# Altium project SwarmBots.PrjPcb
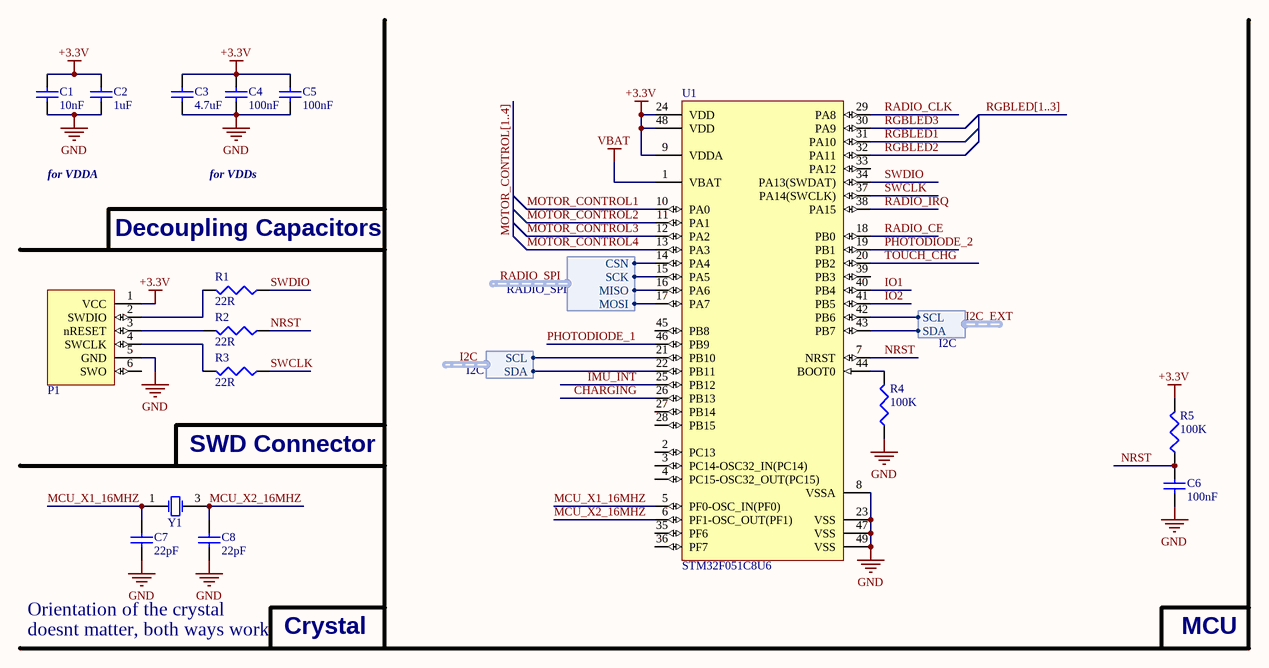
[diagram p0: SBMicrocontroller.SchDoc]
3 sheets, 73 parts. Net scope: global (net labels, ports and power ports of the same name join across sheets).
Board file: SwarmBots.PcbDoc
Sheets:
  SBMicrocontroller.SchDoc
  SBPeripherals.SchDoc
  SBRadio.SchDoc

## Sheet SBMicrocontroller.SchDoc
size A4

### Parts
C1  10nF  [0402]
C2  1uF  [0603]
C3  4.7uF  [0603]
C4  100nF  [0402]
C5  100nF  [0402]
C6  100nF  [0402]
C7  22pF  [0402]
C8  22pF  [0402]
P1  TC2030-IDC-NL  [TC2030-IDC-NL]  (value not drawn)
R1  22R  [0402]
R2  22R  [0402]
R3  22R  [0402]
R4  100K  [0402]
R5  100K  [0402]
U1  STM32F051C8U6  [QFN50P700X700X60_HS-49L]
Y1  7V-16.000MAAE-T  [3.2x2.5 CRYSTAL]  (value not drawn)

### Harnesses
I2C: SDA, SCL
RADIO_SPI: MOSI, MISO, SCK, CSN

### Nets
+3.3V: C1.2 C2.2 C3.2 C4.2 C5.2 P1.1(VCC) R5.2 U1.9(VDDA) U1.24(VDD) U1.48(VDD)
GND: C1.1 C2.1 C3.1 C4.1 C5.1 C6.1 C7.1 C8.1 P1.5(GND) R4.1 U1.8(VSSA) U1.23(VSS) U1.47(VSS) U1.49(VSS) Y1.2(GND) Y1.4(GND)
VBAT: U1.1(VBAT)
CHARGING: U1.26(PB13)
I2C.SCL: U1.21(PB10) ; harness I2C.SCL
I2C.SDA: U1.22(PB11) ; harness I2C.SDA
I2C_EXT.SCL: U1.42(PB6) ; harness I2C.SCL
I2C_EXT.SDA: U1.43(PB7) ; harness I2C.SDA
IMU_INT: U1.25(PB12)
IO1: U1.40(PB4)
IO2: U1.41(PB5)
MCU_X1_16MHZ: C7.2 U1.5(PF0-OSC_IN(PF0)) Y1.1(X1)
MCU_X2_16MHZ: C8.2 U1.6(PF1-OSC_OUT(PF1)) Y1.3(X2)
MOTOR_CONTROL1: U1.10(PA0)
MOTOR_CONTROL2: U1.11(PA1)
MOTOR_CONTROL3: U1.12(PA2)
MOTOR_CONTROL4: U1.13(PA3)
NRST: C6.2 R2.1 R5.1 U1.7(NRST)
PHOTODIODE_1: U1.46(PB9)
PHOTODIODE_2: U1.19(PB1)
RADIO_CE: U1.18(PB0)
RADIO_CLK: U1.29(PA8)
RADIO_IRQ: U1.38(PA15)
RADIO_SPI.CSN: U1.14(PA4) ; harness RADIO_SPI.CSN
RADIO_SPI.MISO: U1.16(PA6) ; harness RADIO_SPI.MISO
RADIO_SPI.MOSI: U1.17(PA7) ; harness RADIO_SPI.MOSI
RADIO_SPI.SCK: U1.15(PA5) ; harness RADIO_SPI.SCK
RGBLED1: U1.31(PA10)
RGBLED2: U1.32(PA11)
RGBLED3: U1.30(PA9)
SWCLK: R3.1 U1.37(PA14(SWCLK))
SWDIO: R1.1 U1.34(PA13(SWDAT))
~{TOUCH_CHG}: U1.20(PB2)
NetP1_2: P1.2(SWDIO) R1.2
NetP1_3: P1.3(nRESET) R2.2
NetP1_4: P1.4(SWCLK) R3.2
NetR4_2: R4.2 U1.44(BOOT0)

Not connected (* = marked no-connect by the designer): P1 6(SWO); U1 2(PC13) 3(PC14-OSC32_IN(PC14)) 4(PC15-OSC32_OUT(PC15)) 27(PB14) 28(PB15) 33(PA12) 35(PF6) 36(PF7) 39(PB3) 45(PB8)

### Buses and harness runs
bus MOTOR_CONTROL[1..4]
bus RGBLED[1..3]

### Notes on the sheet
- for VDDA
- Decoupling Capacitors
- for VDDs
- SWD Connector
- Orientation of the crystal
- doesnt matter, both ways work
- Crystal
- MCU

### Library data of the parts
C1 = 10nF: 10nF 0402 X7R 25V ±5%; Supplier 1: Farnell; Supplier Part Number 1: 1692285; Supplier 2: Digi-Key; Supplier Part Number 2: 399-1279-1-ND; Value: 10nF
C2 = 1uF: 1uF 0603 X5R 10V ±10%; Supplier 1: Farnell; Supplier Part Number 1: 1759399; Supplier 2: Digi-Key; Supplier Part Number 2: 478-1251-1-ND; Value: 1uF
C3 = 4.7uF: 4.7uF 0603 X5R 10V ±10%; Supplier 1: Farnell; Supplier Part Number 1: 2362098; Supplier 2: Digi-Key; Supplier Part Number 2: 445-5170-1-ND; Value: 4.7uF
C4-C6 = 100nF: 100nF 0402 X7R 16V ±10%; Supplier 1: Farnell; Supplier Part Number 1: 1288252; Supplier 2: Digi-Key; Supplier Part Number 2: 399-3521-1-ND; Value: 100nF
C7 C8 = 22pF: 22pF 0402 NP0/CG0 50V ±5%; Supplier 1: Farnell; Supplier 2: Digi-Key; Supplier Part Number 1: 1414580; Supplier Part Number 2: 490-5868-1-ND; Value: 22pF
P1 = TC2030-IDC-NL: TagConnect TC2030-IDC-NL SWD Programming Connector
R1-R3 = 22R: 22R 0402 1/16W ±1%; Supplier 1: Farnell; Supplier 2: Digi-Key; Supplier Part Number 1: 2072797; Supplier Part Number 2: 541-22.0LCT-ND; Value: 22R
R4 R5 = 100K: 100K 0402 1/16W ±1%; Supplier 1: Farnell; Supplier Part Number 1: 2072519; Supplier 2: Digi-Key; Supplier Part Number 2: 541-100KLCT-ND; Value: 100K
U1 = STM32F051C8U6: STMICROELECTRONICS  STM32F051C8U6  MCU 32BIT CORTEX-M0 48MHZ UFQFPN-48; Supplier 1: Farnell; Supplier 2: Digi-Key; Supplier Part Number 1: 2393638; Supplier Part Number 2: STM32F051C8U6-ND
Y1 = 7V-16.000MAAE-T: TXC - 7V-16.000MAAE-T, 16MHZ, 30PPM, 12PF - CRYSTAL; Supplier 1: Digi-Key; Supplier 2: Farnell; Supplier Part Number 1: 887-1462-1-ND; Supplier Part Number 2: 1892172

## Sheet SBPeripherals.SchDoc
size A4
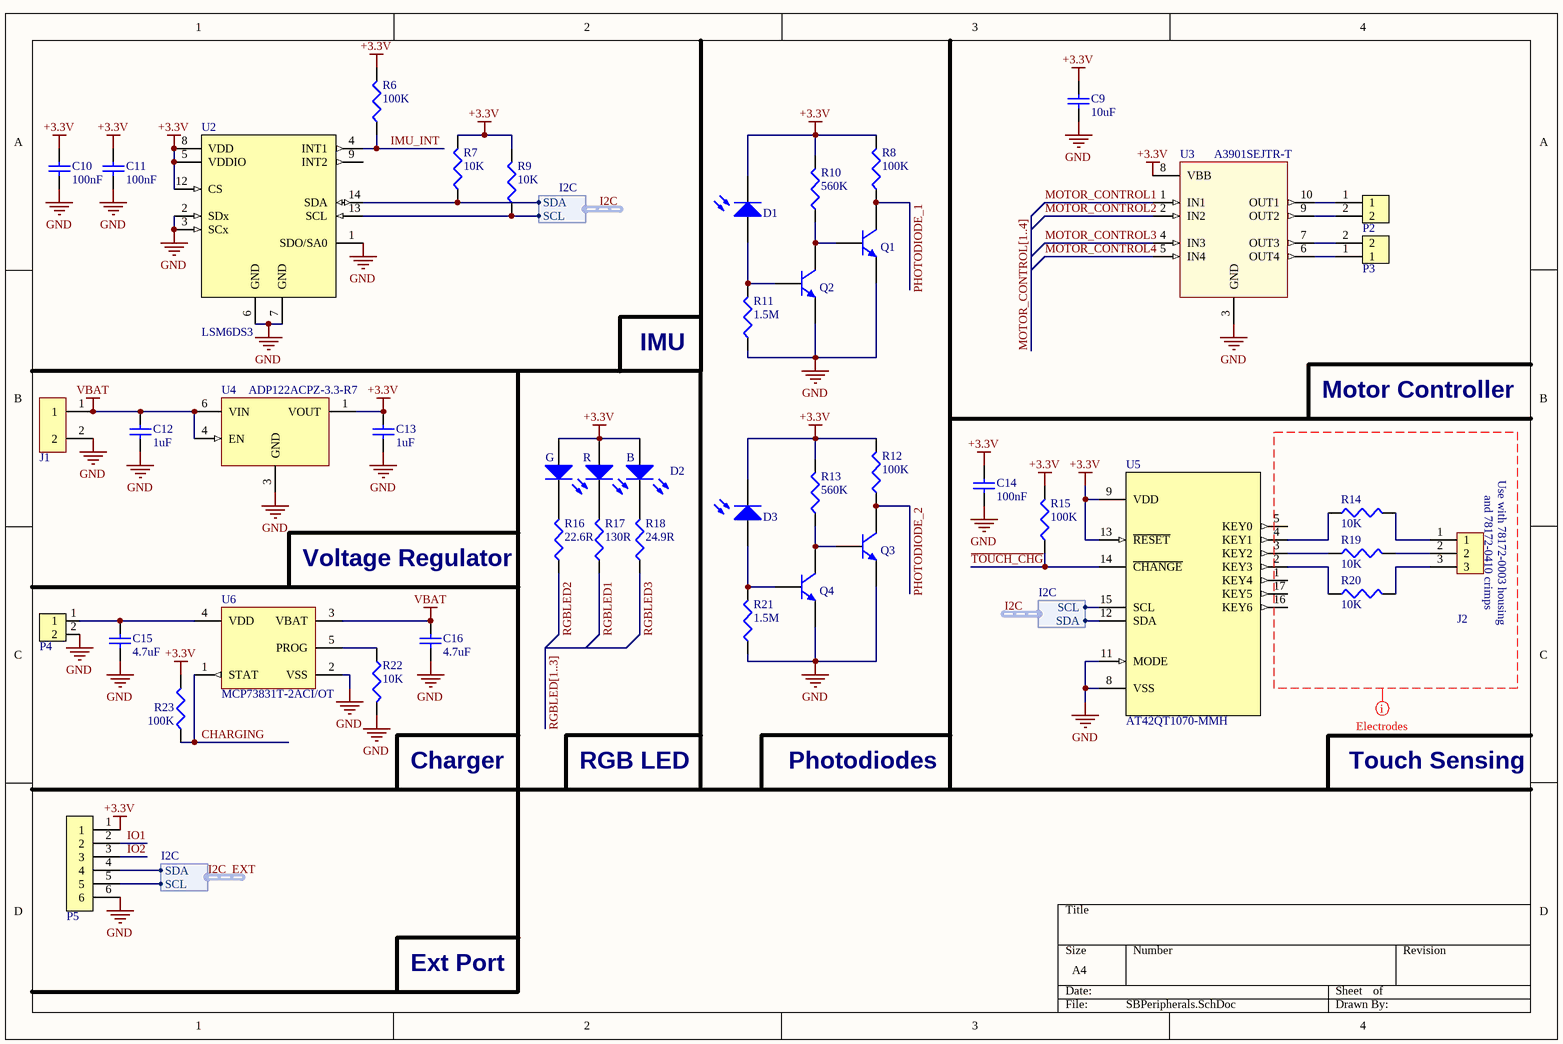
[diagram p1: SBPeripherals.SchDoc]

### Parts
C9  10uF  [0603]
C10  100nF  [0402]
C11  100nF  [0402]
C12  1uF  [0603]
C13  1uF  [0603]
C14  100nF  [0402]
C15  4.7uF  [0603]
C16  4.7uF  [0603]
D1  PD15-22C/TR8  [PD15-22C/TR8]  (value not drawn)
D2  SMLVN6RGB1W1  [3.5x2.8 mm 6-SMD]  (value not drawn)
D3  PD15-22C/TR8  [PD15-22C/TR8]  (value not drawn)
J1  78171-0002  [78171-0002]  (value not drawn)
J2  78171-0003  [78171-0003]  (value not drawn)
P2  HEADER 2X1 0.05" UNPOLARIZED  [HEADER 2X1 0.05" - UNPOLARIZED]  (value not drawn)
P3  HEADER 2X1 0.05" UNPOLARIZED  [HEADER 2X1 0.05" - UNPOLARIZED]  (value not drawn)
P4  CHARGING PAD  [Charging Pad]  (value not drawn)
P5  EXTENSION_PORT  [EXTENSION_PORT]  (value not drawn)
Q1  MMBT3904L  [SOT23_L]  (value not drawn)
Q2  MMBT3904L  [SOT23_L]  (value not drawn)
Q3  MMBT3904L  [SOT23_L]  (value not drawn)
Q4  MMBT3904L  [SOT23_L]  (value not drawn)
R6  100K  [0402]
R7  10K  [0402]
R8  100K  [0402]
R9  10K  [0402]
R10  560K  [0402]
R11  1.5M  [0402]
R12  100K  [0402]
R13  560K  [0402]
R14  10K  [0402]
R15  100K  [0402]
R16  22.6R  [0402]
R17  130R  [0402]
R18  24.9R  [0402]
R19  10K  [0402]
R20  10K  [0402]
R21  1.5M  [0402]
R22  10K  [0402]
R23  100K  [0402]
U2  LSM6DS3  [LGA-14 2.5x3x0.86 mm 14L]
U3  A3901SEJTR-T  [DFN50P300X300X75_HS-11N]
U4  ADP122ACPZ-3.3-R7  [LFCSP-6 2.0X2.0X0.55]
U5  AT42QT1070-MMH  [QFN45P300X300X85_HS-21L]
U6  MCP73831T-2ACI/OT  [SOT-23-OT5_L]

### Harnesses
I2C: SDA, SCL

### Nets
+3.3V: C9.2 C10.2 C11.2 C13.2 C14.2 D1.2(K) D2.1(AB) D2.2(AR) D2.3(AG) D3.2(K) P5.1 R6.2 R7.2 R8.2 R9.2 R10.2 R12.2 R13.2 R15.2 R23.2 U2.5(VDDIO) U2.8(VDD) U2.12(CS) U3.8(VBB) U4.1(VOUT) U5.9(VDD) U5.13(~{RESET})
GND: C9.1 C10.1 C11.1 C12.1 C13.1 C14.1 C15.1 C16.1 J1.2 P4.2 P5.6 Q1.2(E) Q2.2(E) Q3.2(E) Q4.2(E) R11.1 R21.1 R22.2 U2.1(SDO/SA0) U2.2(SDx) U2.3(SCx) U2.6(GND) U2.7(GND) U3.3(GND) U3.11(PAD) U4.2(NC) U4.3(GND) U4.5(NC) U4.7(THPAD) U5.8(VSS) U5.11(MODE) U5.21(PAD) U6.2(VSS)
VBAT: C12.2 C16.2 J1.1 U4.4(EN) U4.6(VIN) U6.3(VBAT)
CHARGING: R23.1 U6.1(STAT)
I2C.SCL: R9.1 U2.13(SCL) U5.15(SCL) ; harness I2C.SCL
I2C.SDA: R7.1 U2.14(SDA) U5.12(SDA) ; harness I2C.SDA
I2C_EXT.SCL: P5.5 ; harness I2C.SCL
I2C_EXT.SDA: P5.4 ; harness I2C.SDA
IMU_INT: R6.1 U2.4(INT1)
IO1: P5.2
IO2: P5.3
MOTOR_CONTROL1: U3.1(IN1)
MOTOR_CONTROL2: U3.2(IN2)
MOTOR_CONTROL3: U3.4(IN3)
MOTOR_CONTROL4: U3.5(IN4)
PHOTODIODE_1: Q1.3(C) R8.1
PHOTODIODE_2: Q3.3(C) R12.1
RGBLED1: R17.1
RGBLED2: R16.1
RGBLED3: R18.1
~{TOUCH_CHG}: R15.1 U5.14(~{CHANGE})
NetC15_2: C15.2 P4.1 U6.4(VDD)
NetD1_1: D1.1(A) Q2.1(B) R11.2
NetD2_4: D2.4(KG) R16.2
NetD2_5: D2.5(KR) R17.2
NetD2_6: D2.6(KB) R18.2
NetD3_1: D3.1(A) Q4.1(B) R21.2
NetJ2_1: J2.1 R14.2
NetJ2_2: J2.2 R19.2
NetJ2_3: J2.3 R20.2
NetP2_1: P2.1 U3.10(OUT1)
NetP2_2: P2.2 U3.9(OUT2)
NetP3_1: P3.1 U3.6(OUT4)
NetP3_2: P3.2 U3.7(OUT3)
NetQ1_1: Q1.1(B) Q2.3(C) R10.1
NetQ3_1: Q3.1(B) Q4.3(C) R13.1
NetR14_1: R14.1 U5.4(KEY1)
NetR19_1: R19.1 U5.3(KEY2)
NetR20_1: R20.1 U5.2(KEY3)
NetR22_1: R22.1 U6.5(PROG)

Not connected (* = marked no-connect by the designer): U2 9(INT2) 10(OCS) 11(NC); U5 1(KEY4) 5(KEY0) 6(NC) 7(NC) 10(NC) 16(KEY6) 17(KEY5) 18(NC) 19(NC) 20(NC)

### Buses and harness runs
bus MOTOR_CONTROL[1..4]
bus RGBLED[1..3]

### Layout directives
net class Electrodes: (no net found under the mark)

### Notes on the sheet
- IMU
- Motor Controller
- Voltage Regulator
- Charger
- RGB LED
- Photodiodes
- Touch Sensing
- Ext Port
- (in symbol 78171-0003) and 78172-0410 crimps; Use with 78172-0003 housing
- (in symbol SMLVN6RGB1W1) G; R; B

### Library data of the parts
C9 = 10uF: 10uF 0603 X5R 6.3V ±20%; Supplier 1: Farnell; Supplier Part Number 1: 2456110; Supplier 2: Digi-Key; Supplier Part Number 2: 490-10475-1-ND; Value: 10uF
C10 C11 C14 = 100nF: 100nF 0402 X7R 16V ±10%; Supplier 1: Farnell; Supplier Part Number 1: 1288252; Supplier 2: Digi-Key; Supplier Part Number 2: 399-3521-1-ND; Value: 100nF
C12 C13 = 1uF: 1uF 0603 X5R 10V ±10%; Supplier 1: Farnell; Supplier Part Number 1: 1759399; Supplier 2: Digi-Key; Supplier Part Number 2: 478-1251-1-ND; Value: 1uF
C15 C16 = 4.7uF: 4.7uF 0603 X5R 10V ±10%; Supplier 1: Farnell; Supplier Part Number 1: 2362098; Supplier 2: Digi-Key; Supplier Part Number 2: 445-5170-1-ND; Value: 4.7uF
D1 D3 = PD15-22C/TR8: Everlight PD15-22C/TR8 Silicon PIN Photodiode; Supplier 1: Digi-Key; Supplier Part Number 1: 1080-1367-1-ND
D2 = SMLVN6RGB1W1: ROHM SMLVN6RGB1W1 LED Tri-Color Blue/Green/Red Chip LED 6-Pin 1411 T/RLED Tri-Color Blue/Green/Red Chip LED 6-Pin 1411; Supplier 1: Mouser; Supplier 2: Digi-Key; Supplier Part Number 1: 755-SMLVN6RGB1W1; Supplier Part Number 2: 846-1187-1-ND
J1 = 78171-0002: Molex Pico-EZmate™ Wire-to-Board Header, 2 contacts; Supplier 1: Farnell; Supplier 2: Digi-Key; Supplier Part Number 1: 2313710; Supplier Part Number 2: WM4459CT-ND
J2 = 78171-0003: Molex Pico-EZmate™ Wire-to-Board Header, 3 contacts; Supplier 1: Farnell; Supplier 2: Digi-Key; Supplier Part Number 1: 2313562; Supplier Part Number 2: WM5409CT-ND
Q1-Q4 = MMBT3904L: On Semiconductor MMBT3904L General Purpose Transistor  NPN Silicon; Supplier 1: Farnell; Supplier 2: Digi-Key; Supplier Part Number 1: 1459100; Supplier Part Number 2: MMBT3904LT1GOSCT-ND
R6 R8 R12 R15 R23 = 100K: 100K 0402 1/16W ±1%; Supplier 1: Farnell; Supplier Part Number 1: 2072519; Supplier 2: Digi-Key; Supplier Part Number 2: 541-100KLCT-ND; Value: 100K
R7 R9 R14 R19 R20 R22 = 10K: 10K 0402 1/16W ±1%; Supplier 1: Farnell; Supplier Part Number 1: 2072517; Supplier 2: Digi-Key; Supplier Part Number 2: 541-10.0KLCT-ND; Value: 10K
R10 R13 = 560K: 560K 0402 1/16W ±1%; Supplier 1: Farnell; Supplier Part Number 1: 2074116; Supplier 2: Digi-Key; Supplier Part Number 2: 311-560KLRCT-ND; Value: 560K
R11 R21 = 1.5M: 1.5M 0402 1/16W ±1%; Supplier 1: Farnell; Supplier Part Number 1: 2141473; Supplier 2: Digi-Key; Supplier Part Number 2: 541-1.50MLCT-ND; Value: 1.5M
R16 = 22.6R: 22.6R 0402 1/16W ±0.05R; Supplier 1: Farnell; Supplier 2: Digi-Key; Supplier Part Number 1: 2302454; Supplier Part Number 2: P22.6LCT-ND; Value: 22.6R
R17 = 130R: 130R 0402 1/16W ±0.05R; Supplier 1: Farnell; Supplier 2: Digi-Key; Supplier Part Number 1: 2059115; Supplier Part Number 2: P130LCT-ND; Value: 130R
R18 = 24.9R: 24.9R 0402 1/16W ±0.05R; Supplier 1: Farnell; Supplier 2: Digi-Key; Supplier Part Number 1: 2059102; Supplier Part Number 2: P24.9LCT-ND; Value: 24.9R
U2 = LSM6DS3: STMicroelectronics iNEMO inertial module:   3D accelerometer and 3D gyroscope; Supplier 1: Farnell; Supplier Part Number 1: 2474253; Supplier 2: Digi-Key; Supplier Part Number 2: 497-15383-1-ND
U3 = A3901SEJTR-T: ALLEGRO MICROSYSTEMS - A3901SEJTR-T - IC, MOTOR DRIVER; Supplier 1: Farnell; Supplier 2: Digi-Key; Supplier Part Number 1: 1651947; Supplier Part Number 2: 620-1159-1-ND
U4 = ADP122ACPZ-3.3-R7: Analog Devices ADP122ACPZ-3.3-R7 - 5.5 V Input, 300 mA, Low Quiescent  Current, CMOS Linear Regulator; Supplier 1: Farnell; Supplier 2: Digi-Key; Supplier Part Number 1: 2457164; Supplier Part Number 2: ADP122ACPZ-3.3-R7CT-ND
U5 = AT42QT1070-MMH: Atmel Seven-channel QTouch® Touch Sensor IC; Supplier 1: Digi-Key; Supplier Part Number 1: AT42QT1070-MMHCT-ND
U6 = MCP73831T-2ACI/OT: Miniature Single-Cell, Fully Integrated Li-Ion, Li-Polymer Charge Management Controller, 4.2V, 5-Pin SOT-23, Industrial Temperature, Tape and Reel; Published: 29-Jan-2009; LatestRevisionDate: 27-Nov-2009; LatestRevisionNote: Updated to datasheet revision E, Sep-2008; DatasheetVersion: revE, Sep-2008; PackageVersion: revBB, Aug-2009; PackageReference: SOT-23-OT5; Publisher: Altium Limited; PackageDescription: 5-Lead Plastic Small Outline Transistor (OT) [SOT-23]; Supplier 1: Farnell; Supplier Part Number 1: 1332158; Code_IPC: SOT23-5; ComponentLink1Description: Datasheet; ComponentLink1URL: http://ww1.microchip.com/downloads/en/DeviceDoc/21984e.pdf; ComponentLink2Description: Packaging Specification; ComponentLink2URL: http://www.microchip.com/stellent/groups/techpub_sg/documents/packagingspec/en012702.pdf; ComponentLink3Description: Microchip.com Home; ComponentLink3URL: http://www.microchip.com/

## Sheet SBRadio.SchDoc
size A4
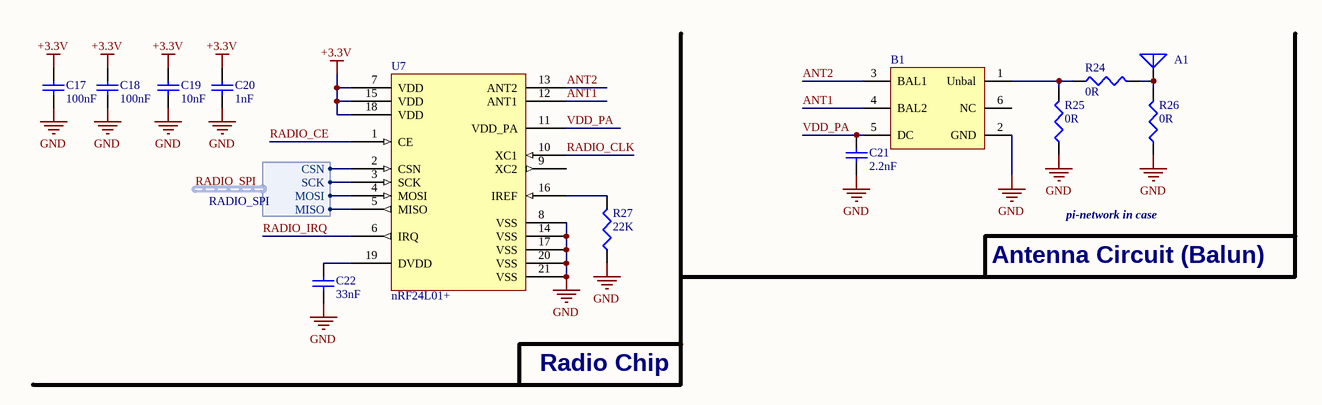
[diagram p2: SBRadio.SchDoc]

### Parts
A1  2450AT18D0100  [2450AT18D0100]  (value not drawn)
B1  2450BM14A0002T  [2450BM14A0002]  (value not drawn)
C17  100nF  [0402]
C18  100nF  [0402]
C19  10nF  [0402]
C20  1nF  [0402]
C21  2.2nF  [0402]
C22  33nF  [0402]
R24  0R  [0402]
R25  0R  [0402]
R26  0R  [0402]
R27  value 22K  [0402]  (hidden comment: 22K 0402 1/16W ±1%)
U7  nRF24L01+  [QFN50P400X400X95_HS-21L]

### Harnesses
RADIO_SPI: MOSI, MISO, SCK, CSN

### Nets
+3.3V: C17.2 C18.2 C19.2 C20.2 U7.7(VDD) U7.15(VDD) U7.18(VDD)
GND: A1.2(GND) B1.2(GND) C17.1 C18.1 C19.1 C20.1 C21.1 C22.1 R25.1 R26.1 R27.1 U7.8(VSS) U7.14(VSS) U7.17(VSS) U7.20(VSS) U7.21(VSS)
ANT1: B1.4(BAL2) U7.12(ANT1)
ANT2: B1.3(BAL1) U7.13(ANT2)
RADIO_CE: U7.1(CE)
RADIO_CLK: U7.10(XC1)
RADIO_IRQ: U7.6(IRQ)
RADIO_SPI.CSN: U7.2(CSN) ; harness RADIO_SPI.CSN
RADIO_SPI.MISO: U7.5(MISO) ; harness RADIO_SPI.MISO
RADIO_SPI.MOSI: U7.4(MOSI) ; harness RADIO_SPI.MOSI
RADIO_SPI.SCK: U7.3(SCK) ; harness RADIO_SPI.SCK
VDD_PA: B1.5(DC) C21.2 U7.11(VDD_PA)
NetA1_1: A1.1(A) R24.2 R26.2
NetB1_1: B1.1(Unbal) R24.1 R25.2
NetC22_2: C22.2 U7.19(DVDD)
NetR27_2: R27.2 U7.16(IREF)

Not connected (* = marked no-connect by the designer): B1 6(NC); U7 9(XC2)

### Notes on the sheet
- pi-network in case
- Antenna Circuit (Balun)
- Radio Chip

### Library data of the parts
A1 = 2450AT18D0100: JOHANSON TECHNOLOGY 2450AT18D0100  ANTENNA, CERAMIC, 2.45GHZ; Supplier 1: Mouser; Supplier 2: Digi-Key; Supplier Part Number 1: 609-2450AT18D0100E; Supplier Part Number 2: 712-1573-1-ND
B1 = 2450BM14A0002T: Johanson Technology Impedance Matched Balun Filter Integrated Passive for nRF24L01; Supplier 1: Farnell; Supplier 2: Digi-Key; Supplier Part Number 1: 2148533; Supplier Part Number 2: 712-1574-1-ND
C17 C18 = 100nF: 100nF 0402 X7R 16V ±10%; Supplier 1: Farnell; Supplier Part Number 1: 1288252; Supplier 2: Digi-Key; Supplier Part Number 2: 399-3521-1-ND; Value: 100nF
C19 = 10nF: 10nF 0402 X7R 25V ±5%; Supplier 1: Farnell; Supplier Part Number 1: 1692285; Supplier 2: Digi-Key; Supplier Part Number 2: 399-1279-1-ND; Value: 10nF
C20 = 1nF: 1nF 0402 X7R 50V ±10%; Supplier 1: Farnell; Supplier 2: Digi-Key; Supplier Part Number 1: 1414573; Supplier Part Number 2: 399-1032-1-ND; Value: 1nF
C21 = 2.2nF: 2.2nF 0402 X7R 50V ±10%; Supplier 1: Farnell; Supplier 2: Digi-Key; Supplier Part Number 1: 1414582; Supplier Part Number 2: 399-3068-1-ND; Value: 2.2nF
C22 = 33nF: 33nF 0402 X7R 50V ±10%; Supplier 1: Farnell; Supplier 2: Digi-Key; Supplier Part Number 1: 2210826; Supplier Part Number 2: 445-7334-1-ND; Value: 33nF
R24-R26 = 0R: 0R 0402 1/16W ±0.05R; Supplier 1: Farnell; Supplier 2: Digi-Key; Supplier Part Number 1: 2072513; Supplier Part Number 2: P0.0JCT-ND; Value: 0R
R27 = 22K: Supplier 1: Farnell; Supplier 2: Digi-Key; Supplier Part Number 1: 2072781; Supplier Part Number 2: 541-22.0KLCT-ND
U7 = nRF24L01+: Nordic Semi Ultra low power 2.4GHz RF Transceiver IC; Supplier 1: Digi-Key; Supplier Part Number 1: 1490-1033-1-ND

## Nets that join several sheets
+3.3V: SBMicrocontroller (10 pins), SBPeripherals (27 pins), SBRadio (7 pins)
GND: SBMicrocontroller (16 pins), SBPeripherals (33 pins), SBRadio (16 pins)
VBAT: SBMicrocontroller (U1.1), SBPeripherals (6 pins)
CHARGING: SBMicrocontroller (U1.26), SBPeripherals (R23.1 U6.1)
I2C.SCL: SBMicrocontroller (U1.21), SBPeripherals (R9.1 U2.13 U5.15)
I2C.SDA: SBMicrocontroller (U1.22), SBPeripherals (R7.1 U2.14 U5.12)
I2C_EXT.SCL: SBMicrocontroller (U1.42), SBPeripherals (P5.5)
I2C_EXT.SDA: SBMicrocontroller (U1.43), SBPeripherals (P5.4)
IMU_INT: SBMicrocontroller (U1.25), SBPeripherals (R6.1 U2.4)
IO1: SBMicrocontroller (U1.40), SBPeripherals (P5.2)
IO2: SBMicrocontroller (U1.41), SBPeripherals (P5.3)
MOTOR_CONTROL1: SBMicrocontroller (U1.10), SBPeripherals (U3.1)
MOTOR_CONTROL2: SBMicrocontroller (U1.11), SBPeripherals (U3.2)
MOTOR_CONTROL3: SBMicrocontroller (U1.12), SBPeripherals (U3.4)
MOTOR_CONTROL4: SBMicrocontroller (U1.13), SBPeripherals (U3.5)
PHOTODIODE_1: SBMicrocontroller (U1.46), SBPeripherals (Q1.3 R8.1)
PHOTODIODE_2: SBMicrocontroller (U1.19), SBPeripherals (Q3.3 R12.1)
RADIO_CE: SBMicrocontroller (U1.18), SBRadio (U7.1)
RADIO_CLK: SBMicrocontroller (U1.29), SBRadio (U7.10)
RADIO_IRQ: SBMicrocontroller (U1.38), SBRadio (U7.6)
RADIO_SPI.CSN: SBMicrocontroller (U1.14), SBRadio (U7.2)
RADIO_SPI.MISO: SBMicrocontroller (U1.16), SBRadio (U7.5)
RADIO_SPI.MOSI: SBMicrocontroller (U1.17), SBRadio (U7.4)
RADIO_SPI.SCK: SBMicrocontroller (U1.15), SBRadio (U7.3)
RGBLED1: SBMicrocontroller (U1.31), SBPeripherals (R17.1)
RGBLED2: SBMicrocontroller (U1.32), SBPeripherals (R16.1)
RGBLED3: SBMicrocontroller (U1.30), SBPeripherals (R18.1)
~{TOUCH_CHG}: SBMicrocontroller (U1.20), SBPeripherals (R15.1 U5.14)